# Altium schematic sheet 13.SchDoc
size 513 x 386 mm
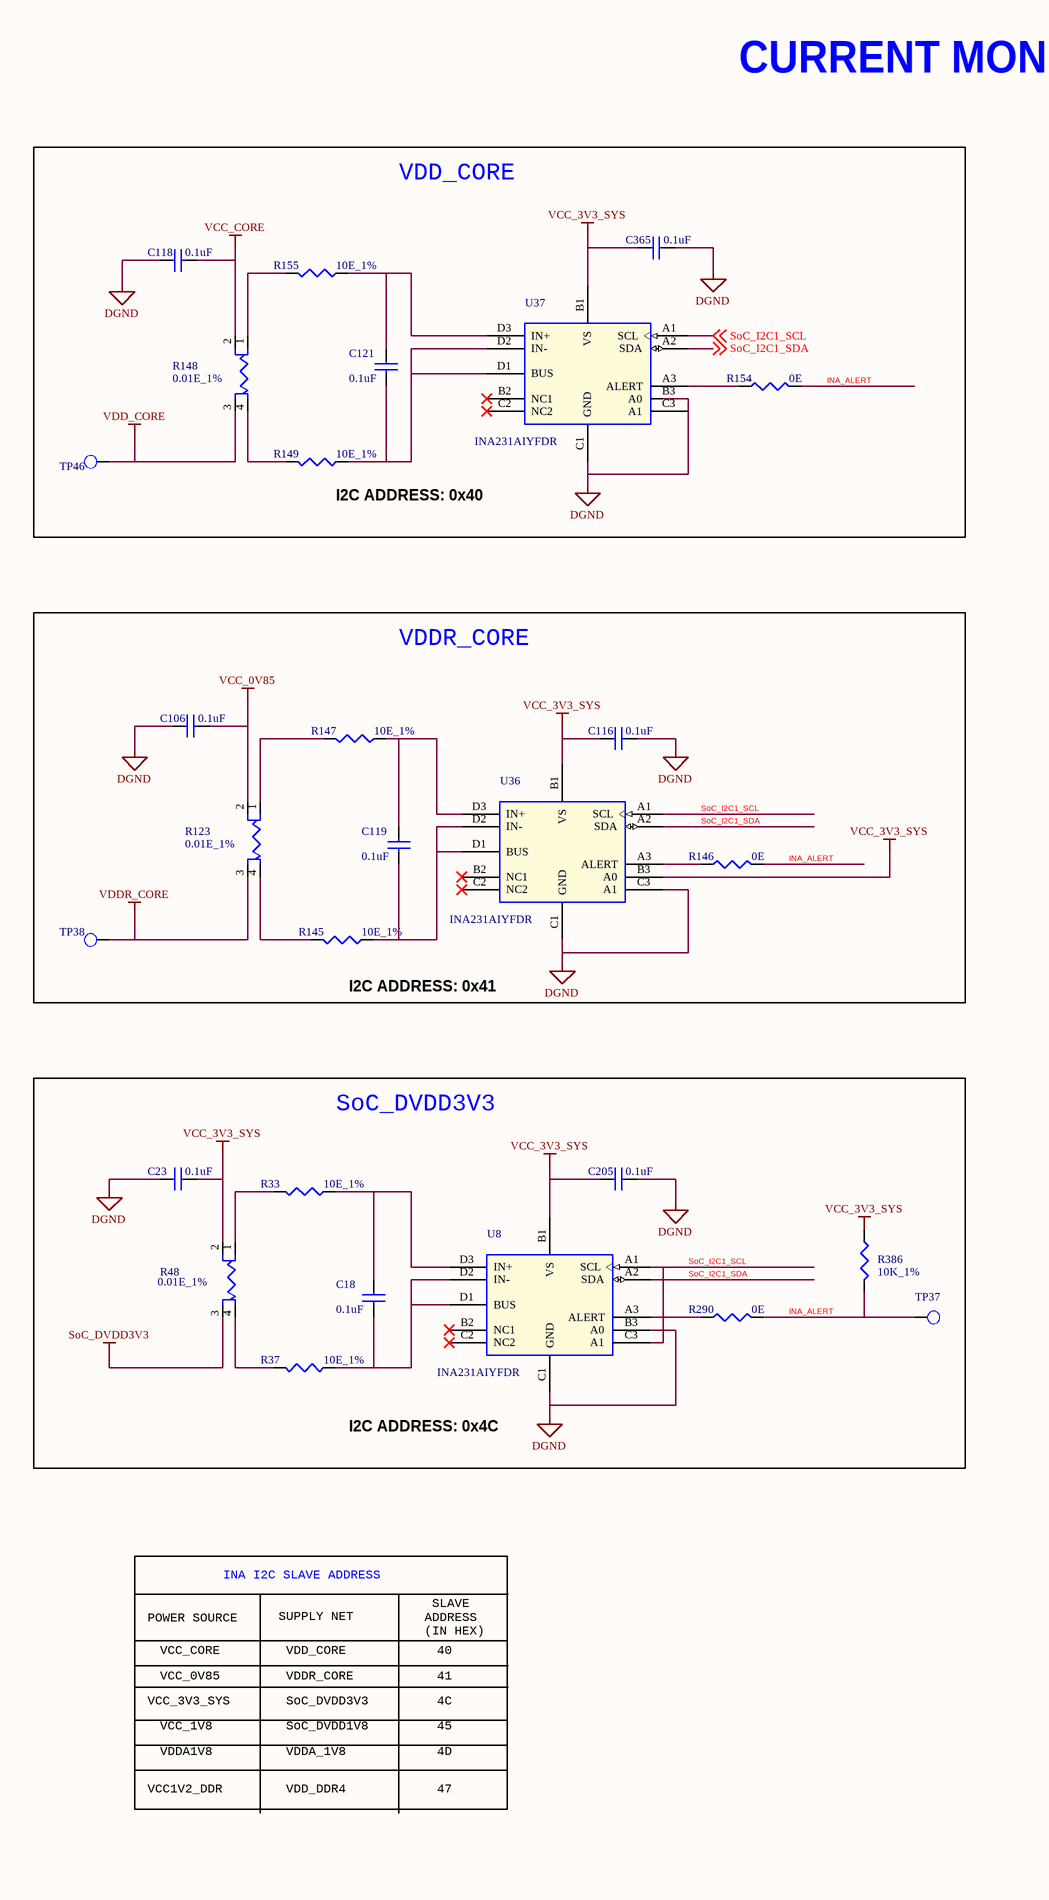
[diagram p0: 13.SchDoc, left]
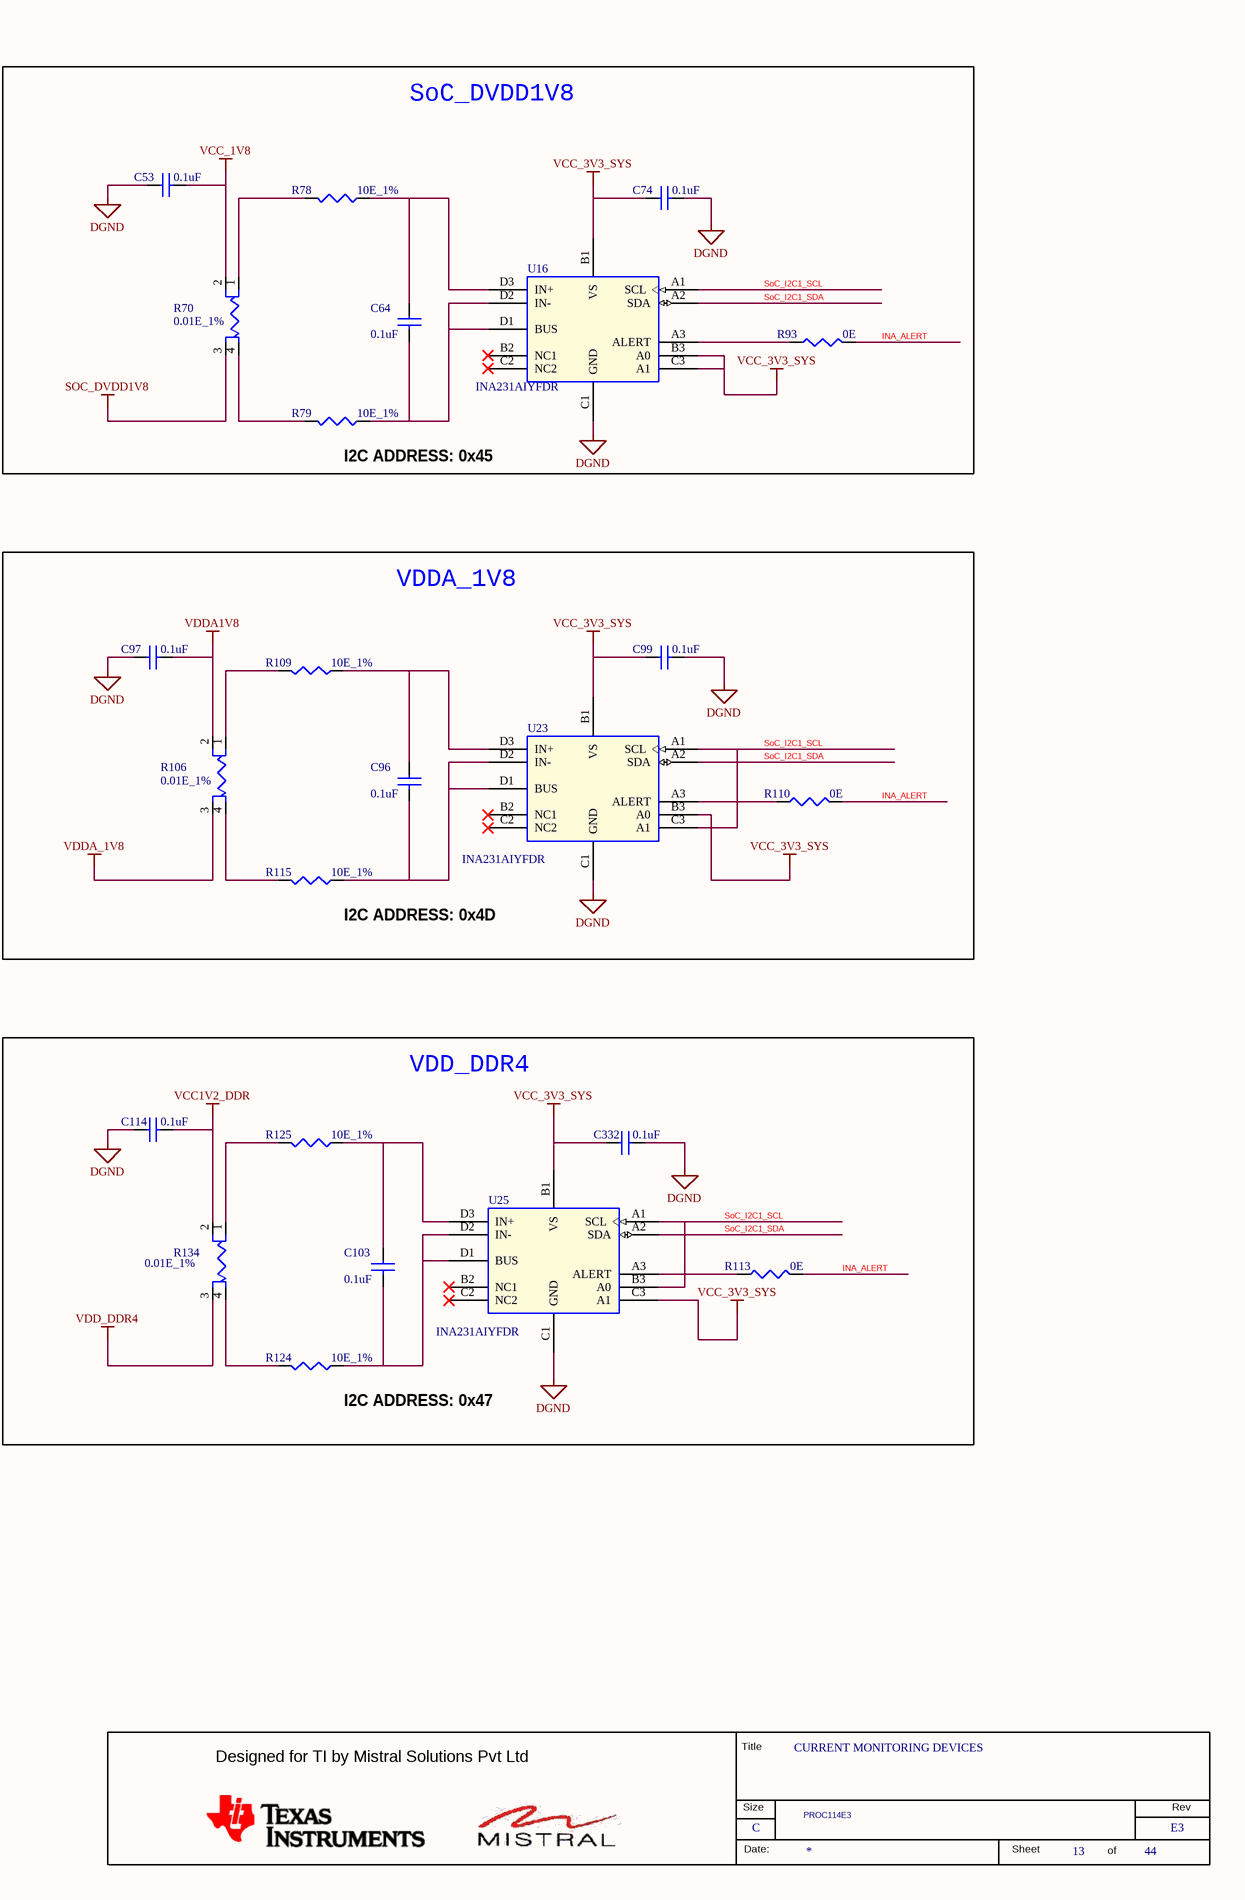
[diagram p1: 13.SchDoc, right]

## Parts
*  RevCode: E3  Title: CURRENT MONITORING DEVICES  Page Size: C  Page Number: 13  Page Count: 44  Variant Name: PROC114E3  (hidden comment: MISTRAL_TITLEBLK_CSIZE)  (graphical)
C18  0.1uF  [CAP0402_0-75]
C23  0.1uF  [CAP0402_0-75]
C53  0.1uF  [CAP0402_0-75]
C64  0.1uF  [CAP0402_0-75]
C74  0.1uF  [CAP0402_0-75]
C96  0.1uF  [CAP0402_0-75]
C97  0.1uF  [CAP0402_0-75]
C99  0.1uF  [CAP0402_0-75]
C103  0.1uF  [CAP0402_0-75]
C106  0.1uF  [CAP0402_0-75]
C114  0.1uF  [CAP0402_0-75]
C116  0.1uF  [CAP0402_0-75]
C118  0.1uF  [CAP0402_0-75]
C119  0.1uF  [CAP0402_0-75]
C121  0.1uF  [CAP0402_0-75]
C205  0.1uF  [CAP0402_0-75]
C332  0.1uF  [CAP0402_0-75]
C365  0.1uF  [CAP0402_0-75]
R33  10E_1%  [RES0402_0-5]
R37  10E_1%  [RES0402_0-5]
R48  0.01E_1%  [RES_KRL3216T4_1206-4_0-7]
R70  0.01E_1%  [RES_KRL3216T4_1206-4_0-7]
R78  10E_1%  [RES0402_0-5]
R79  10E_1%  [RES0402_0-5]
R93  0E  [RES0402_0-5]
R106  0.01E_1%  [RES_KRL3216T4_1206-4_0-7]
R109  10E_1%  [RES0402_0-5]
R110  0E  [RES0402_0-5]
R113  0E  [RES0402_0-5]
R115  10E_1%  [RES0402_0-5]
R123  0.01E_1%  [RES_KRL3216T4_1206-4_0-7]
R124  10E_1%  [RES0402_0-5]
R125  10E_1%  [RES0402_0-5]
R134  0.01E_1%  [RES_KRL3216T4_1206-4_0-7]
R145  10E_1%  [RES0402_0-5]
R146  0E  [RES0402_0-5]
R147  10E_1%  [RES0402_0-5]
R148  0.01E_1%  [RES_KRL3216T4_1206-4_0-7]
R149  10E_1%  [RES0402_0-5]
R154  0E  [RES0402_0-5]
R155  10E_1%  [RES0402_0-5]
R290  0E  [RES0402_0-5]
R386  10K_1%  [RES0402N]
TP37  TP20_SMD  [TP20_SMD]  (value not drawn)
TP38  TP20_SMD  [TP20_SMD]  (value not drawn)
TP46  TP20_SMD  [TP20_SMD]  (value not drawn)
U8  INA231AIYFDR  [DSBGA12_15-74_60X70_0-4]
U16  INA231AIYFDR  [DSBGA12_15-74_60X70_0-4]
U23  INA231AIYFDR  [DSBGA12_15-74_60X70_0-4]
U25  INA231AIYFDR  [DSBGA12_15-74_60X70_0-4]
U36  INA231AIYFDR  [DSBGA12_15-74_60X70_0-4]
U37  INA231AIYFDR  [DSBGA12_15-74_60X70_0-4]

## Blocks framed on the sheet
VDD_CORE: C118 C121 C365 R148 R149 R154 R155 TP46 U37
SoC_DVDD1V8: C53 C64 C74 R70 R78 R79 R93 U16
VDDR_CORE: C106 C116 C119 R123 R145-R147 TP38 U36
VDDA_1V8: C96 C97 C99 R106 R109 R110 R115 U23
SoC_DVDD3V3: C18 C23 C205 R33 R37 R48 R290 R386 TP37 U8
VDD_DDR4: C103 C114 C332 R113 R124 R125 R134 U25

## Nets
DGND: C23.1 C53.1 C74.2 C97.1 C99.2 C106.1 C114.1 C116.2 C118.1 C205.2 C332.2 C365.2 U8.B3(A0) U8.C1(GND) U16.C1(GND) U23.C1(GND) U25.C1(GND) U36.C1(GND) U36.C3(A1) U37.B3(A0) U37.C1(GND) U37.C3(A1)
SOC_DVDD1V8: R70.3
SoC_DVDD3V3: R48.3
VCC1V2_DDR: C114.2 R134.2
VCC_0V85: C106.2 R123.2
VCC_1V8: C53.2 R70.2
VCC_3V3_SYS: C23.2 C74.1 C99.1 C116.1 C205.1 C332.1 C365.1 R48.2 R386.2 U8.B1(VS) U16.B1(VS) U16.B3(A0) U16.C3(A1) U23.B1(VS) U23.B3(A0) U25.B1(VS) U25.C3(A1) U36.B1(VS) U36.B3(A0) U37.B1(VS)
VCC_CORE: C118.2 R148.2
VDD_CORE: R148.3 TP46.1(TP)
VDD_DDR4: R134.3
VDDA1V8: C97.2 R106.2
VDDA_1V8: R106.3
VDDR_CORE: R123.3 TP38.1(TP)
INA_ALERT: R93.2 R110.2 R113.2 R146.2 R154.2 R290.2 R386.1 TP37.1(TP)
SoC_I2C1_SCL: U8.A1(SCL) U8.C3(A1) U16.A1(SCL) U23.A1(SCL) U23.C3(A1) U25.A1(SCL) U25.B3(A0) U36.A1(SCL) U37.A1(SCL) ; off-sheet SoC_I2C1_SCL
SoC_I2C1_SDA: U8.A2(SDA) U16.A2(SDA) U23.A2(SDA) U25.A2(SDA) U36.A2(SDA) U37.A2(SDA) ; off-sheet SoC_I2C1_SDA
NetC18_1: C18.1 R33.1 U8.D3(IN+)
NetC18_2: C18.2 R37.1 U8.D1(BUS) U8.D2(IN-)
NetC64_1: C64.1 R78.1 U16.D3(IN+)
NetC64_2: C64.2 R79.1 U16.D1(BUS) U16.D2(IN-)
NetC96_1: C96.1 R109.1 U23.D3(IN+)
NetC96_2: C96.2 R115.1 U23.D1(BUS) U23.D2(IN-)
NetC103_1: C103.1 R125.1 U25.D3(IN+)
NetC103_2: C103.2 R124.1 U25.D1(BUS) U25.D2(IN-)
NetC119_1: C119.1 R147.1 U36.D3(IN+)
NetC119_2: C119.2 R145.1 U36.D1(BUS) U36.D2(IN-)
NetC121_1: C121.1 R155.1 U37.D3(IN+)
NetC121_2: C121.2 R149.1 U37.D1(BUS) U37.D2(IN-)
NetR33_2: R33.2 R48.1
NetR37_2: R37.2 R48.4
NetR70_1: R70.1 R78.2
NetR70_4: R70.4 R79.2
NetR93_1: R93.1 U16.A3(ALERT)
NetR106_1: R106.1 R109.2
NetR106_4: R106.4 R115.2
NetR110_1: R110.1 U23.A3(ALERT)
NetR113_1: R113.1 U25.A3(ALERT)
NetR123_1: R123.1 R147.2
NetR123_4: R123.4 R145.2
NetR124_2: R124.2 R134.4
NetR125_2: R125.2 R134.1
NetR146_1: R146.1 U36.A3(ALERT)
NetR148_1: R148.1 R155.2
NetR148_4: R148.4 R149.2
NetR154_1: R154.1 U37.A3(ALERT)
NetR290_1: R290.1 U8.A3(ALERT)

Not connected (* = marked no-connect by the designer): U8 B2(NC1)* C2(NC2)*; U16 B2(NC1)* C2(NC2)*; U23 B2(NC1)* C2(NC2)*; U25 B2(NC1)* C2(NC2)*; U36 B2(NC1)* C2(NC2)*; U37 B2(NC1)* C2(NC2)*

## Notes on the sheet
- CURRENT MONITORING DEVICES
- (near R149) I2C ADDRESS: 0x40
- (near R79) I2C ADDRESS: 0x45
- (near R145) I2C ADDRESS: 0x41
- (near R115) I2C ADDRESS: 0x4D
- I2C ADDRESS: 0x4C
- (near R124) I2C ADDRESS: 0x47
- INA I2C SLAVE ADDRESS
- SLAVE
  ADDRESS
  (IN HEX)
- POWER SOURCE
- VCC_CORE
- SUPPLY NET
- VDD_CORE
- 40
- VCC_3V3_SYS
- VCC_0V85
- VDDR_CORE
- SoC_DVDD3V3
- 41
- 4C
- VCC_1V8
- VDDA1V8
- SoC_DVDD1V8
- VDDA_1V8
- 45
- 4D
- VCC1V2_DDR
- VDD_DDR4
- 47
- (in symbol MISTRAL_TITLEBLK_CSIZE) Title; Designed for TI by Mistral Solutions Pvt Ltd; Size; Rev; Date:; Sheet; of

## Library data of the parts
* = MISTRAL_TITLEBLK_CSIZE: Issue: 1.0; Page Create Date: March  8, 1995; Page Modify Date: *; Schematic Page Count: 44; Schematic Page Number: 13
C18 C23 C53 C96 C106 C114 C365 = CAP_Dup2: CAP CERAMIC 0.1uF 50V 10% X7R 0402; Alt_Mfr_part_number: CC0402KRX5R8BB104; Mistral Part No: 120011100014-R; Mfr_name: MURATA; Mfr_part_number: GRM155R71H104KE14D; Part_type: CAPACITORS\CERAMIC; Alt_Mfr_name: YAGEO AMERICA; Project: J7_CP; Wattage: NA; Customs_HS_Code: 85322990; Custom_Duty: 15%; PCB Footprint: CAP0402_0-75; Tolerance: 10%; Voltage: 50V; Package: 0402; Distributor_name: DIGIKEY; Distributor_part_number: 490-10700-1-ND; Height: 0.55MM; Weight: 3.1mg; Temperature: -55°C+125°C; Datasheet: Y:\MIS_DATABASE\DATASHEETS\CAPACITORS\GRM155R71H104KE14.PDF; Crtd /date: ALVY/211020; Chkd/date: MANIRAJA/261020; MECHANICAL 3D STEP FILE: CAP0402_0-75; Library Ref: CAP; Footprint Ref: CAP0402_0-75; Library Path: Y:\MIS_DATABASE\Library\ALTIUM_TOOL\SCHEMATICS_PARTS\MS_DISCRETE_Library.schlib; Footprint Path: Y:\MIS_DATABASE\Library\ALTIUM_TOOL\PCB_FOOTPRINTS\Altium_Footprint_Lib.PcbLib
C64 C74 C97 C99 C103 C116 C118 C119 C121 C205 C332 = CAP_Dup2: CAP CERAMIC 0.1uF 50V 10% X7R 0402; Alt_Mfr_name: YAGEO AMERICA; Part_type: CAPACITORS\CERAMIC; Mfr_part_number: GRM155R71H104KE14D; Mfr_name: MURATA; Mistral Part No: 120011100014-R; Alt_Mfr_part_number: CC0402KRX5R8BB104; Custom_Duty: 15%; Customs_HS_Code: 85322990; Wattage: NA; Project: J7_CP; PCB Footprint: CAP0402_0-75; Footprint Path: Y:\MIS_DATABASE\Library\ALTIUM_TOOL\PCB_FOOTPRINTS\Altium_Footprint_Lib.PcbLib; Library Path: Y:\MIS_DATABASE\Library\ALTIUM_TOOL\SCHEMATICS_PARTS\MS_DISCRETE_Library.schlib; Footprint Ref: CAP0402_0-75; Library Ref: CAP; MECHANICAL 3D STEP FILE: CAP0402_0-75; Chkd/date: MANIRAJA/261020; Crtd /date: ALVY/211020; Datasheet: Y:\MIS_DATABASE\DATASHEETS\CAPACITORS\GRM155R71H104KE14.PDF; Temperature: -55°C+125°C; Weight: 3.1mg; Height: 0.55MM; Distributor_part_number: 490-10700-1-ND; Distributor_name: DIGIKEY; Package: 0402; Voltage: 50V; Tolerance: 10%
R33 R37 R79 R115 R124 R147 R149 R155 = RESISTOR_Dup6: RES 10E 1/16W 1% 0402; Part_type: RESISTORS\FIXED; Mfr_part_number: RC0402FR-0710RL; Mfr_name: YAGEO AMERICA; Mistral Part No: 110018020004-R; Custom_Duty: 15%; Customs_HS_Code: 85332119; Voltage: NA; Project: TI_MAXIE_CPB; PCB Footprint: RES0402_0-5; Footprint Path: Y:\MIS_DATABASE\Library\ALTIUM_TOOL\PCB_FOOTPRINTS\Altium_Footprint_Lib.PcbLib; Library Path: Y:\MIS_DATABASE\Library\ALTIUM_TOOL\SCHEMATICS_PARTS\MS_DISCRETE_Library.schlib; Footprint Ref: RES0402_0-5; MECHANICAL 3D STEP FILE: RES0402_0-5; Chkd/date: MANIRAJA/070218; Crtd /date: ALVY/070218; Datasheet: Y:\MIS_DATABASE\DATASHEETS\RESISTORS\RCXXXXL-SER_MAR18.PDF; Temperature: -55°C+155°C; Weight: 0.65mg; Height: 0.40MM; Distributor_part_number: 311-10.0LRCT-ND; Distributor_name: DIGIKEY; Package: 0402; Wattage: 1/16W; Tolerance: 1%; Library Ref: RESISTOR
R48 R70 R106 = RESISTOR-4TERM: RES 0.01E 1W 1% 1206-4; Mistral Part No: 110018030003-R; Mfr_name: SUSUMU; Mfr_part_number: KRL3216T4A-M-R010-F-T1; Part_type: RESISTORS\FIXED; Project: GRACO SMART MODULE; Voltage: NA; Customs_HS_Code: 85332119; Custom_Duty: 15%; PCB Footprint: RES_KRL3216T4_1206-4_0-7; Library Ref: RESISTOR-4TERM; Tolerance: 1%; Wattage: 1W; Package: 1206-4; Distributor_name: DIGIKEY; Distributor_part_number: 408-1974-1-ND; Height: 0.70MM; Weight: 16.2mg; Temperature: -55°C+155°C; Datasheet: Y:\MIS_DATABASE\DATASHEETS\RESISTORS\KRL-SERIES.PDF; Crtd /date: MANIRAJA/060318; Chkd/date: MANIRAJA/060318; MECHANICAL 3D STEP FILE: RES_KRL3216T4_1206-4_0-7; Footprint Ref: RES_KRL3216T4_1206-4_0-7; Library Path: Y:\MIS_DATABASE\Library\ALTIUM_TOOL\SCHEMATICS_PARTS\MS_DISCRETE_Library.schlib; Footprint Path: Y:\MIS_DATABASE\Library\ALTIUM_TOOL\PCB_FOOTPRINTS\Altium_Footprint_Lib.PcbLib
R78 R109 R125 R145 = RESISTOR_Dup6: RES 10E 1/16W 1% 0402; Mistral Part No: 110018020004-R; Mfr_name: YAGEO AMERICA; Mfr_part_number: RC0402FR-0710RL; Part_type: RESISTORS\FIXED; Project: TI_MAXIE_CPB; Voltage: NA; Customs_HS_Code: 85332119; Custom_Duty: 15%; PCB Footprint: RES0402_0-5; Library Ref: RESISTOR; Tolerance: 1%; Wattage: 1/16W; Package: 0402; Distributor_name: DIGIKEY; Distributor_part_number: 311-10.0LRCT-ND; Height: 0.40MM; Weight: 0.65mg; Temperature: -55°C+155°C; Datasheet: Y:\MIS_DATABASE\DATASHEETS\RESISTORS\RCXXXXL-SER_MAR18.PDF; Crtd /date: ALVY/070218; Chkd/date: MANIRAJA/070218; MECHANICAL 3D STEP FILE: RES0402_0-5; Footprint Ref: RES0402_0-5; Library Path: Y:\MIS_DATABASE\Library\ALTIUM_TOOL\SCHEMATICS_PARTS\MS_DISCRETE_Library.schlib; Footprint Path: Y:\MIS_DATABASE\Library\ALTIUM_TOOL\PCB_FOOTPRINTS\Altium_Footprint_Lib.PcbLib
R93 R113 = RESISTOR_Dup4: RES 0E 1/16W JUMPER 0402; Part_type: RESISTORS\FIXED; Mfr_part_number: CRCW04020000Z0ED; Mfr_name: VISHAY; Mistral Part No: 110010080019-R; Custom_Duty: 15%; Customs_HS_Code: 85332119; Voltage: NA; Project: PB_BUGBASE; PCB Footprint: RES0402_0-5; Footprint Path: Y:\MIS_DATABASE\Library\ALTIUM_TOOL\PCB_FOOTPRINTS\Altium_Footprint_Lib.PcbLib; Library Path: Y:\MIS_DATABASE\Library\ALTIUM_TOOL\SCHEMATICS_PARTS\MS_DISCRETE_Library.schlib; Footprint Ref: RES0402_0-5; Library Ref: RESISTOR; Chkd/date: VASANTHA/201216; Crtd /date: MUDDU/190810; Datasheet: Y:\MIS_DATABASE\DATASHEETS\RESISTORS\CRCW0603.PDF; Temperature: -55°C+155°C; Weight: 0.65mg; Height: 0.40MM; Distributor_part_number: 541-0.0JCT-ND; Distributor_name: DIGIKEY; Package: 0402; Wattage: 1/16W; Tolerance: NA; MECHANICAL 3D STEP FILE: RES0402_0-5
R110 R146 R154 R290 = RESISTOR_Dup4: RES 0E 1/16W JUMPER 0402; Mistral Part No: 110010080019-R; Mfr_name: VISHAY; Mfr_part_number: CRCW04020000Z0ED; Part_type: RESISTORS\FIXED; Project: PB_BUGBASE; Tolerance: NA; Customs_HS_Code: 85332119; Custom_Duty: 15%; PCB Footprint: RES0402_0-5; MECHANICAL 3D STEP FILE: RES0402_0-5; Voltage: NA; Wattage: 1/16W; Package: 0402; Distributor_name: DIGIKEY; Distributor_part_number: 541-0.0JCT-ND; Height: 0.40MM; Weight: 0.65mg; Temperature: -55°C+155°C; Datasheet: Y:\MIS_DATABASE\DATASHEETS\RESISTORS\CRCW0603.PDF; Crtd /date: MUDDU/190810; Chkd/date: VASANTHA/201216; Library Ref: RESISTOR; Footprint Ref: RES0402_0-5; Library Path: Y:\MIS_DATABASE\Library\ALTIUM_TOOL\SCHEMATICS_PARTS\MS_DISCRETE_Library.schlib; Footprint Path: Y:\MIS_DATABASE\Library\ALTIUM_TOOL\PCB_FOOTPRINTS\Altium_Footprint_Lib.PcbLib
R123 R134 R148 = RESISTOR-4TERM: RES 0.01E 1W 1% 1206-4; Part_type: RESISTORS\FIXED; Mfr_part_number: KRL3216T4A-M-R010-F-T1; Mfr_name: SUSUMU; Mistral Part No: 110018030003-R; Custom_Duty: 15%; Customs_HS_Code: 85332119; Voltage: NA; Project: GRACO SMART MODULE; PCB Footprint: RES_KRL3216T4_1206-4_0-7; Footprint Path: Y:\MIS_DATABASE\Library\ALTIUM_TOOL\PCB_FOOTPRINTS\Altium_Footprint_Lib.PcbLib; Library Path: Y:\MIS_DATABASE\Library\ALTIUM_TOOL\SCHEMATICS_PARTS\MS_DISCRETE_Library.schlib; Footprint Ref: RES_KRL3216T4_1206-4_0-7; MECHANICAL 3D STEP FILE: RES_KRL3216T4_1206-4_0-7; Chkd/date: MANIRAJA/060318; Crtd /date: MANIRAJA/060318; Datasheet: Y:\MIS_DATABASE\DATASHEETS\RESISTORS\KRL-SERIES.PDF; Temperature: -55°C+155°C; Weight: 16.2mg; Height: 0.70MM; Distributor_part_number: 408-1974-1-ND; Distributor_name: DIGIKEY; Package: 1206-4; Wattage: 1W; Tolerance: 1%; Library Ref: RESISTOR-4TERM
R386 = RESISTOR_Dup3: RES 10K 1/20W 1% 0201; Part_type: RESISTORS\FIXED; Mfr_part_number: RC0201FR-0710KL; Mfr_name: YAGEO AMERICA; Mistral Part No: 110011040018-R; PCB Footprint: RES0201_0-5; Voltage: NA; Custom_Duty: 15%; Customs_HS_Code: 85332119; Project: GOLDEN-I LITE; Footprint Path: Y:\MIS_DATABASE\Library\ALTIUM_TOOL\PCB_FOOTPRINTS\Altium_Footprint_Lib.PcbLib; Library Path: Y:\MIS_DATABASE\Library\ALTIUM_TOOL\SCHEMATICS_PARTS\MS_DISCRETE_Library.schlib; Footprint Ref: RES0201_0-5; Library Ref: RESISTOR; MECHANICAL 3D STEP FILE: RES0201_0-5; Temperature: -55°C+125°C; Weight: 0.17mg; Chkd/date: VASANTHA/270117; Crtd /date: MANIRAJA/270117; Datasheet: Y:\MIS_DATABASE\DATASHEETS\RESISTORS\RCXXXXL-SER_MAR18.PDF; Height: 0.26MM; Distributor_part_number: 311-10.0KMCT-ND; Distributor_name: DIGIKEY; Package: 0201; Wattage: 1/20W; Tolerance: 1%
TP37 TP38 TP46 = TESTPOINT: TESTPOINT CIR 20 SMD; Mfr_name: LOCAL; Custom_Duty: NA; Project: BT MODULE_CSRBC04; PCB Footprint: TP20_SMD; Customs_HS_Code: NA; Chkd/date: SHREESHAIL/171006; Crtd /date: MAZHAR/171006; Height: NA; Distributor_part_number: NA; Distributor_name: NA; Package: SMD; Part_type: TESTPOINT; Mfr_part_number: TP20_SMD; Mistral Part No: NA; Tolerance: NA; Voltage: NA; Wattage: NA; Weight: NA; Temperature: NA; Datasheet: NA; MECHANICAL 3D STEP FILE: NA; Library Path: Y:\MIS_DATABASE\Library\ALTIUM_TOOL\SCHEMATICS_PARTS\MS_DISCRETE_Library.schlib; Footprint Path: Y:\MIS_DATABASE\Library\ALTIUM_TOOL\PCB_FOOTPRINTS\Altium_Footprint_Lib.PcbLib; Library Ref: TESTPOINT; Footprint Ref: TP20_SMD; RoHS: NA
U8 U23 U36 U37 = INA231_DSBGA12: IC HIGH OR LOW SIDE MEASUREMENT BI-DIR CURRENT AND POWER MONITOR WITH 1.8V I2C INTERFACE DSBGA12; Part_type: ICS\POWER\MANAGEMENT; Mfr_name: TEXAS INSTRUMENTS; Mistral Part No: 142021080022-R; Custom_Duty: 15%; Customs_HS_Code: 85423100; Wattage: NA; Project: TI_AM62x SVB_BRD; PCB Footprint: DSBGA12_15-74_60X70_0-4; Footprint Path: Y:\MIS_DATABASE\Library\ALTIUM_TOOL\PCB_FOOTPRINTS\Altium_Footprint_Lib.PcbLib; Library Path: Y:\MIS_DATABASE\Library\ALTIUM_TOOL\SCHEMATICS_PARTS\MS_MISCPOWER_Library.schlib; MECHANICAL 3D STEP FILE: DSBGA12_15-74_60X70_0-4; Chkd/date: MANIRAJA/250821; Crtd /date: ALVY/250821; Datasheet: Y:\MIS_DATABASE\DATASHEETS\ICS\POWER\INA231XXX.PDF; Temperature: -40°C+125°C; Weight: 200mg; Height: 0.40MM; Library Ref: INA231_DSBGA12; Distributor_part_number: 296-49645-1-ND; Distributor_name: DIGIKEY; Package: DSBGA12; Voltage: NA; Tolerance: NA; Mfr_part_number: INA231AIYFDR; Footprint Ref: DSBGA12_15-74_60X70_0-4
U16 U25 = INA231_DSBGA12: IC HIGH OR LOW SIDE MEASUREMENT BI-DIR CURRENT AND POWER MONITOR WITH 1.8V I2C INTERFACE DSBGA12; Mistral Part No: 142021080022-R; Mfr_name: TEXAS INSTRUMENTS; Part_type: ICS\POWER\MANAGEMENT; Project: TI_AM62x SVB_BRD; Tolerance: NA; Customs_HS_Code: 85423100; Custom_Duty: 15%; Footprint Ref: DSBGA12_15-74_60X70_0-4; Mfr_part_number: INA231AIYFDR; Voltage: NA; Wattage: NA; Package: DSBGA12; Distributor_name: DIGIKEY; Distributor_part_number: 296-49645-1-ND; Library Ref: INA231_DSBGA12; Height: 0.40MM; Weight: 200mg; Temperature: -40°C+125°C; Datasheet: Y:\MIS_DATABASE\DATASHEETS\ICS\POWER\INA231XXX.PDF; Crtd /date: ALVY/250821; Chkd/date: MANIRAJA/250821; MECHANICAL 3D STEP FILE: DSBGA12_15-74_60X70_0-4; Library Path: Y:\MIS_DATABASE\Library\ALTIUM_TOOL\SCHEMATICS_PARTS\MS_MISCPOWER_Library.schlib; Footprint Path: Y:\MIS_DATABASE\Library\ALTIUM_TOOL\PCB_FOOTPRINTS\Altium_Footprint_Lib.PcbLib; PCB Footprint: DSBGA12_15-74_60X70_0-4